# EAGLE design long-3.3v (EAGLE 7.2.0)
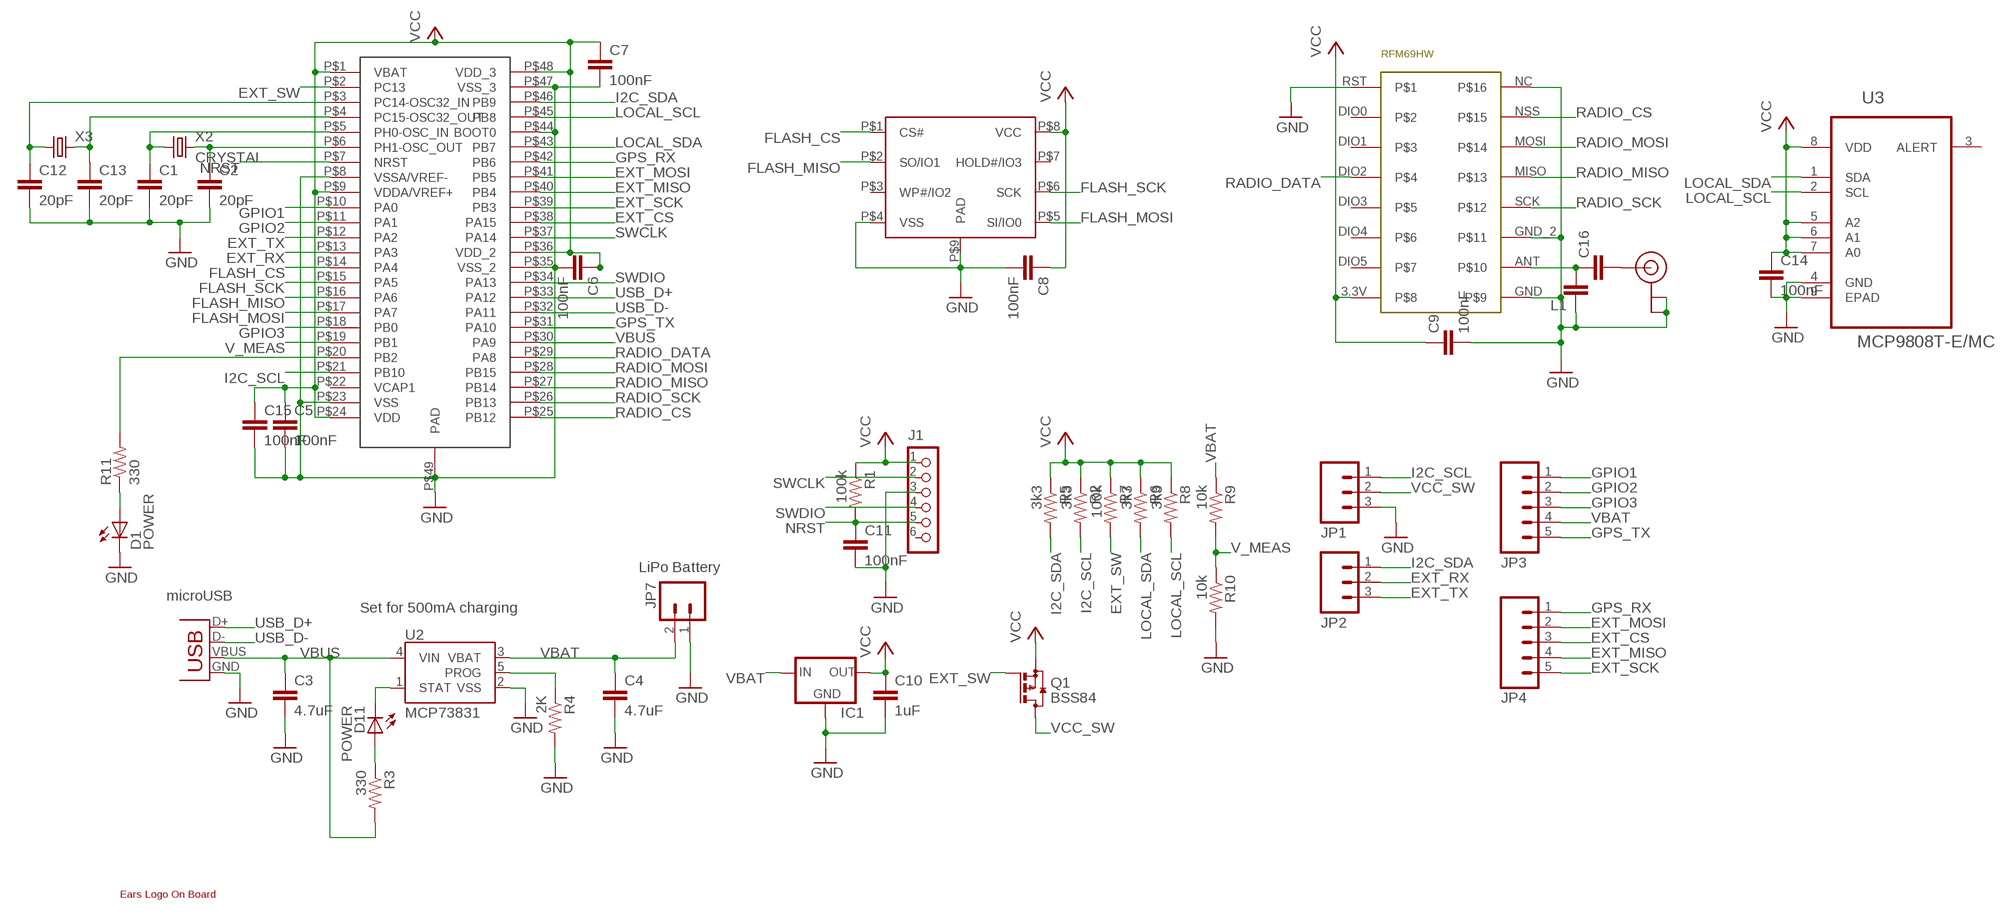
[diagram p0: schematic, sheet 1]

## Parts
C1  20pF  C-EUC0402  [C0402]
C2  20pF  C-EUC0402  [C0402]
C3  4.7uF  CAP0402-CAP  [0402-CAP]
C4  4.7uF  CAP0402-CAP  [0402-CAP]
C5  100nF  C-EUC0402  [C0402]
C6  100nF  C-EUC0402  [C0402]
C7  100nF  C-EUC0402  [C0402]
C8  100nF  C-EUC0402  [C0402]
C9  100nF  C-EUC0402  [C0402]
C10  1uF  C-EUC0402  [C0402]
C11  100nF  C-EUC0402  [C0402]
C12  20pF  C-EUC0402  [C0402]
C13  20pF  C-EUC0402  [C0402]
C14  100nF  C-EUC0402  [C0402]
C15  100nF  C-EUC0402  [C0402]
C16  C-EUC0402  [C0402]
D1  POWER  LED0603  [LED-0603]
D11  POWER  LED0603  [LED-0603]
IC1  XC63FPM  [SOT23]
J1  CON_HEADER_1X06-SMD-RIGHT-ANGLED  [M1X6_MALE_RIGHT_ANGLED_SMD]
JP1  M03PTH  [1X03]
JP2  M03PTH  [1X03]
JP3  M05PTH  [1X05]
JP4  M05PTH  [1X05]
JP7  LiPo Battery  M02-JST-2MM-SMT  [JST-2-SMD]
L1  C-EUC0402  [C0402]
Q1  BSS84  [SOT23]
R1  100k  RESISTOR0402-RES  [0402-RES]
R2  3k3  RESISTOR0402-RES  [0402-RES]
R3  330  RESISTOR0402-RES  [0402-RES]
R4  2K  RESISTOR0402-RES  [0402-RES]
R5  3k3  RESISTOR0402-RES  [0402-RES]
R6  3k3  RESISTOR0402-RES  [0402-RES]
R7  100k  RESISTOR0402-RES  [0402-RES]
R8  3k3  RESISTOR0402-RES  [0402-RES]
R9  10k  RESISTOR0402-RES  [0402-RES]
R10  10k  RESISTOR0402-RES  [0402-RES]
R11  330  RESISTOR0402-RES  [0402-RES]
U2  MCP73831  [SOT23-5]
U3  MCP9808T-E/MC  [DFN300X200X100-9N]
U$1  STM32F411CEU6  [STM32F411CEU6]
U$2  EARS-LOGO  [EARS-LOGO]
U$3  RFM69HW  [RFM69HW]
U$4  U.FL  [U.FL]
U$5  S25FL256  [WSON-8]
X1  Micro USB  USB-MICROB  [USB-MICROB]
X2  CRYSTAL  ABRACON_ABM3_CRYSTAL  [ABRACON_ABM3_CRYSTAL]
X3  CRYSTALS-NOGND-IQXC-25  [2.0X1.2-2PAD]

## Nets
EXT_CS: JP4.3 U$1.P$38(PA15)
EXT_MISO: JP4.4 U$1.P$40(PB4)
EXT_MOSI: JP4.2 U$1.P$41(PB5)
EXT_RX: JP2.2 U$1.P$13(PA3)
EXT_SCK: JP4.5 U$1.P$39(PB3)
EXT_SW: Q1.1(G) R7.2 U$1.P$2(PC13)
EXT_TX: JP2.3 U$1.P$12(PA2)
FLASH_CS: U$1.P$14(PA4) U$5.P$1(CS#)
FLASH_MISO: U$1.P$16(PA6) U$5.P$2(SO/IO1)
FLASH_MOSI: U$1.P$17(PA7) U$5.P$5(SI/IO0)
FLASH_SCK: U$1.P$15(PA5) U$5.P$6(SCK)
GND: C1.2 C2.2 C3.2 C4.2 C5.2 C6.2 C7.2 C8.2 C9.2 C10.2 C11.2 C12.2 C13.2 C14.2 C15.2 D1.C IC1.1(GND) J1.3 JP1.3 JP7.1 L1.1 R4.2 R10.2 U2.2(VSS) U3.4(GND) U3.9(EPAD) U$1.P$8(VSSA/VREF-) U$1.P$23(VSS) U$1.P$35(VSS_2) U$1.P$44(BOOT0) U$1.P$47(VSS_3) U$1.P$49(PAD) U$3.GND U$3.GND_2 U$3.NC U$3.RST U$4.P$1(GND) U$4.P$2(GND) U$5.P$4(VSS) U$5.P$9(PAD) X1.GND
GPIO1: JP3.1 U$1.P$10(PA0)
GPIO2: JP3.2 U$1.P$11(PA1)
GPIO3: JP3.3 U$1.P$18(PB0)
GPS_RX: JP4.1 U$1.P$42(PB6)
GPS_TX: JP3.5 U$1.P$31(PA10)
I2C_SCL: JP1.1 R2.2 U$1.P$21(PB10)
I2C_SDA: JP2.1 R5.2 U$1.P$46(PB9)
LOCAL_SCL: R8.2 U3.2(SCL) U$1.P$45(PB8)
LOCAL_SDA: R6.2 U3.1(SDA) U$1.P$43(PB7)
N$1: C1.1 U$1.P$5(PH0-OSC_IN) X2.P$1
N$2: C2.1 U$1.P$6(PH1-OSC_OUT) X2.P$2
N$3: D11.A R3.1
N$4: C16.2 U$4.P$3(SIGNAL)
N$5: C16.1 L1.2 U$3.ANT
N$6: C13.1 U$1.P$4(PC15-OSC32_OUT) X3.2
N$7: C12.1 U$1.P$3(PC14-OSC32_IN) X3.1
N$8: D1.A R11.1
N$9: R11.2 U$1.P$20(PB2)
NRST: C11.1 J1.5 R1.2 U$1.P$7(NRST)
PROG: R4.1 U2.5(PROG)
RADIO_CS: U$1.P$25(PB12) U$3.NSS
RADIO_DATA: U$1.P$29(PA8) U$3.DIO2
RADIO_MISO: U$1.P$27(PB14) U$3.MISO
RADIO_MOSI: U$1.P$28(PB15) U$3.MOSI
RADIO_SCK: U$1.P$26(PB13) U$3.SCK
STAT: D11.C U2.1(STAT)
SWCLK: J1.2 U$1.P$37(PA14)
SWDIO: J1.4 U$1.P$34(PA13)
USB_D+: U$1.P$33(PA12) X1.D+
USB_D-: U$1.P$32(PA11) X1.D-
V_MEAS: R9.2 R10.1 U$1.P$19(PB1)
VBAT: C4.1 IC1.3(IN) JP3.4 JP7.2 R9.1 U2.3(VBAT)
VBUS: C3.1 R3.2 U2.4(VIN) U$1.P$30(PA9) X1.VBUS
VCC: C5.1 C6.1 C7.1 C8.1 C9.1 C10.1 C14.1 C15.1 IC1.2(OUT) J1.1 Q1.2(S) R1.1 R2.1 R5.1 R6.1 R7.1 R8.1 U3.5(A2) U3.6(A1) U3.7(A0) U3.8(VDD) U$1.P$1(VBAT) U$1.P$9(VDDA/VREF+) U$1.P$24(VDD) U$1.P$36(VDD_2) U$1.P$48(VDD_3) U$3.3.3V U$5.P$8(VCC)
VCC_SW: JP1.2 Q1.3(D)
Unconnected: J1.6 U3.3(ALERT) U$1.P$22(VCAP1) U$3.DIO0 U$3.DIO1 U$3.DIO3 U$3.DIO4 U$3.DIO5 U$5.P$3(WP#/IO2) U$5.P$7(HOLD#/IO3)

## Notes on the sheet
- microUSB
- Set for 500mA charging

## Library data of the parts
C1 C2 C5-C16 L1 = rcl:C-EU: CAPACITOR, European symbol
C3 C4 = SparkFun:CAP: Capacitor Standard 0603 ceramic capacitor, and 0.1" leaded capacitor.
D1 D11 = SparkFun:LED: LEDs Standard schematic elements and footprints for 5mm, 3mm, 1206, and 0603 sized LEDs. 5mm - Spark Fun Electronics SKU : COM-00529 (and others)
IC1 = v-reg:XC63FP: Positiv Voltage Regulators www.torex.co.jp/english/product/pro02/pdf/0201_xc62fp.pdf
J1 = dp_devices:CON_HEADER_1X06
JP1 JP2 = SparkFun:M03: Header 3 Standard 3-pin 0.1" header. Use with straight break away headers (SKU : PRT-00116), right angle break away headers (PRT-00553), swiss pins (PRT-00743), machine pins (PRT-00117), and female headers (PRT-00115). Molex polarized connector foot print use with SKU : PRT-08232 with associated crimp pins and housings.
JP3 JP4 = SparkFun:M05: Header 5 Standard 5-pin 0.1" header. Use with straight break away headers (SKU : PRT-00116), right angle break away headers (PRT-00553), swiss pins (PRT-00743), machine pins (PRT-00117), and female headers (PRT-00115). Molex polarized connector foot print use with SKU : PRT-08230 with associated crimp pins and housings.
JP7 = SparkFun:M02: Header 2 Standard 2-pin 0.1" header. Use with straight break away headers (SKU : PRT-00116), right angle break away headers (PRT-00553), swiss pins (PRT-00743), machine pins (PRT-00117), and female headers (PRT-00115). Molex polarized connector foot print use with SKU : PRT-08233 with associated crimp pins and housings.
Q1 = transistor-small-signal:BSS84: P-CHANNEL MOS FET
R1-R11 = SparkFun:RESISTOR: Resistor Basic schematic elements and footprints for 0603, 1206, and PTH resistors.
U2 = SparkFun:MCP73831: Microchip's MCP73831 Miniature single cell, fully integrated Li-Ion, Li-polymer charge management controller http://ww1.microchip.com/downloads/en/DeviceDoc/21984a.pdf
U3 = mattsLib:MCP9808T-E/MC: TEMP SENSOR, I2C, -20 TO 100 DEG, 8DFN; MPN: MCP9808T-E/MC; OC_FARNELL: 2080524; OC_NEWARK: 73T0714; PACKAGE: 8DFN; SUPPLIER: Microchip
U$1 = STM32F411CEU6:STM32F411CEU6
U$2 = earsLogo:EARS-LOGO
U$3 = RFM69HW:RFM69HW
U$4 = SparkFun:U.FL
U$5 = mattsLib:S25FL256; OC_FARNELL: 2136254
X1 = SparkFun:USB: USB Connectors USB-B-PTH is fully proven SKU : PRT-00139 USB-miniB is fully proven SKU : PRT-00587 USB-A-PCB is untested. USB-A-H is throughly reviewed, but untested. Spark Fun Electronics SKU : PRT-00437 USB-B-SMT is throughly reviewed, but untested. Needs silkscreen touching up. USB-A-S has not been used/tested USB-MB-H has not been used/tested
X2 = Ava:ABRACON_ABM3_CRYSTAL; OC_FARNELL: 2101329
X3 = IQD-Frequency-Products:CRYSTALS-NOGND: CRYSTALS CAN NOT GROUNDED; OC_FARNELL: 2449502

## Board
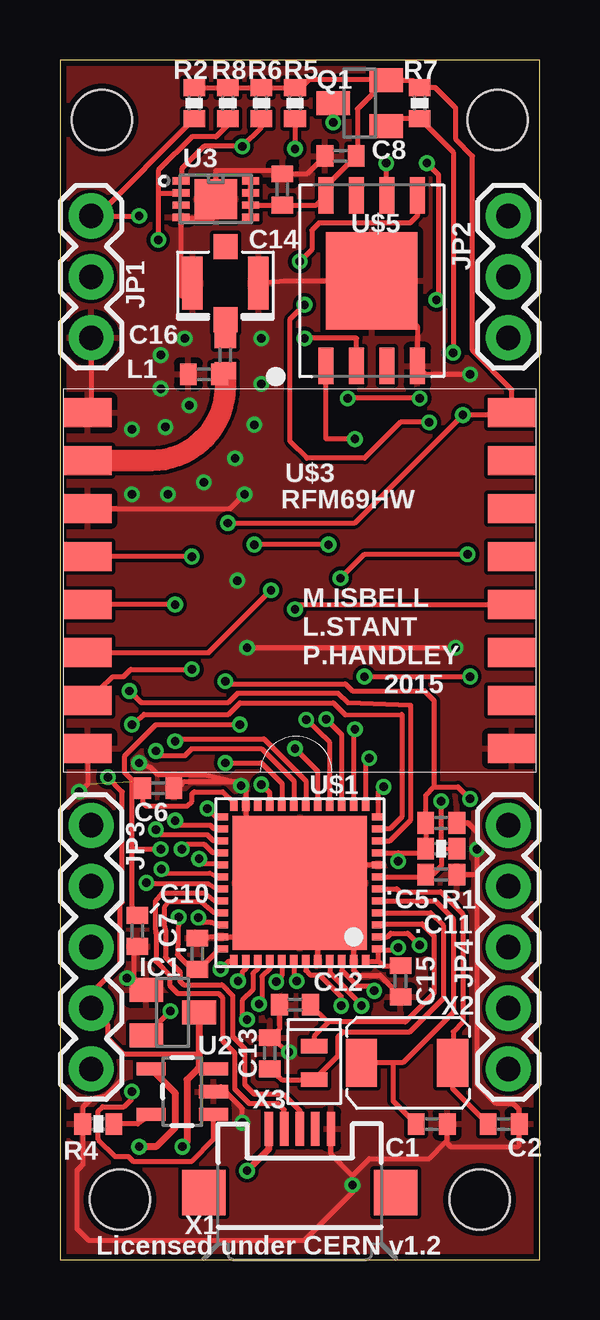
[diagram p1: board, top side]
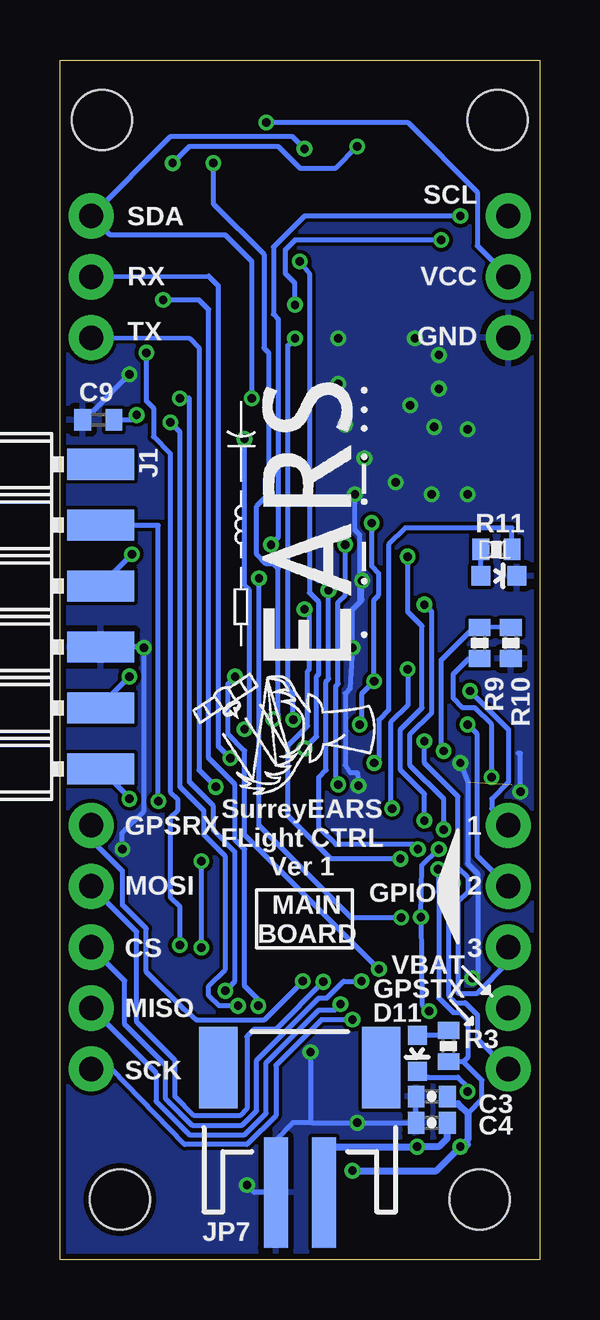
[diagram p2: board, bottom side, seen from below]

Size 20 x 50 mm. Coordinates in mm from the lower left corner, seen from the top.
Outline: 0,0 20,0 20,50 0,50 0,0
Copper layers (1*16): Top 0.035mm / dielectric 1.5mm / Bottom 0.035mm
Design rules "Elecrow_2-layer_eagle_rule": minimum track width 6mil, minimum drill 12mil, track to track 6mil, track to pad 6mil, pad to pad 6mil, via to via 6mil, smd to smd 0mil, copper to edge 10mil, drill to drill 10mil, minimum pad ring 10mil, minimum via ring 6mil, stop-mask expansion 2mil, vias tented up to drill 100mil, thermal gap 10mil
Holes 2.5 mm at 1.75,47.5 18.25,47.5 2.5,2.5 17.5,2.5
tKeepout: area 0,45 to 4.2,50; area 15.8,45 to 20,50; area 0,0 to 5,5; area 15,0 to 20,5
bKeepout: area 15.8,45 to 20,50; area 0,45 to 4.2,50; area 15,0 to 20,5; area 0,0 to 5,5
tRestrict: area 6,39.9 to 7.8,41.6

### Footprints (pad centres in the part's own frame; a part is rotated, then mirrored left to right if it is on the bottom)
C0402 = smd 0.7 x 0.9: 1 -0.65,0; 2 0.65,0
0402-CAP = smd 0.7 x 0.9: 1 -0.65,0; 2 0.65,0
LED-0603 = smd 0.8 x 0.8: A 0,-0.75; C 0,0.75
SOT23 = smd 1 x 1.4: 1 -0.95,-1.1; 2 0.95,-1.1; 3 0,1.1
M1X6_MALE_RIGHT_ANGLED_SMD = smd 1.3 x 2.8: 1 -6.35,-3.3; 2 -3.81,-3.3; 3 -1.27,-3.3; 4 1.27,-3.3; 5 3.81,-3.3; 6 6.35,-3.3
1X03 = drill 1.016 pad 1.88: 1 0,0; 2 2.54,0; 3 5.08,0
1X05 = drill 1.016 pad 1.88: 1 0,0; 2 2.54,0; 3 5.08,0; 4 7.62,0; 5 10.16,0
JST-2-SMD = smd 1 x 4.6: 1 -1,-3.7; 2 1,-3.7 | smd 1.6 x 3.4: NC1 -3.4,1.5; NC2 3.4,1.5
0402-RES = smd 0.7 x 0.9: 1 -0.65,0; 2 0.65,0
SOT23-5 = smd 0.55 x 1.2: 1 -0.95,-1.3; 2 0,-1.3; 3 0.95,-1.3; 4 0.95,1.3; 5 -0.95,1.3
DFN300X200X100-9N = smd 0.711 x 0.305: 1 -1.448,0.762; 2 -1.448,0.254; 3 -1.448,-0.254; 4 -1.448,-0.762; 5 1.448,-0.762; 6 1.448,-0.254; 7 1.448,0.254; 8 1.448,0.762 | smd 1.753 x 1.651: 9 0,0
STM32F411CEU6 = smd 0.55 x 0.3: P$1 0.225,6.25; P$2 0.225,5.75; P$3 0.225,5.25; P$4 0.225,4.75; P$5 0.225,4.25; P$6 0.225,3.75; P$7 0.225,3.25; P$8 0.225,2.75; P$9 0.225,2.25; P$10 0.225,1.75; P$11 0.225,1.25; P$12 0.225,0.75; P$25 6.775,0.75; P$26 6.775,1.25; P$27 6.775,1.75; P$28 6.775,2.25; P$29 6.775,2.75; P$30 6.775,3.25; P$31 6.775,3.75; P$32 6.775,4.25; P$33 6.775,4.75; P$34 6.775,5.25; P$35 6.775,5.75; P$36 6.775,6.25 | smd 0.3 x 0.55: P$13 0.75,0.225; P$14 1.25,0.225; P$15 1.75,0.225; P$16 2.25,0.225; P$17 2.75,0.225; P$18 3.25,0.225; P$19 3.75,0.225; P$20 4.25,0.225; P$21 4.75,0.225; P$22 5.25,0.225; P$23 5.75,0.225; P$24 6.25,0.225; P$37 6.25,6.775; P$38 5.75,6.775; P$39 5.25,6.775; P$40 4.75,6.775; P$41 4.25,6.775; P$42 3.75,6.775; P$43 3.25,6.775; P$44 2.75,6.775; P$45 2.25,6.775; P$46 1.75,6.775; P$47 1.25,6.775; P$48 0.75,6.775 | smd 5.6 x 5.6: P$49 3.5,3.5
RFM69HW = smd 2 x 1.2: 3.3V -9,-7.2; ANT 8.7,-5.2; DIO0 -9,4.8; DIO1 -9,2.8; DIO2 -9,0.8; DIO3 -9,-1.2; DIO4 -9,-3.2; DIO5 -9,-5.2; GND 8.7,-7.2; GND_2 8.7,-3.2; MISO 8.7,0.8; MOSI 8.7,2.8; NC 8.7,6.8; NSS 8.7,4.8; RST -9,6.8; SCK 8.7,-1.2
U.FL = smd 2.2 x 0.85: P$1 0,1.375; P$2 0,-1.375 | smd 1.05 x 1: P$3 1.525,0; P$4 -1.525,0
WSON-8 = smd 1.524 x 0.635: P$1 -3.556,1.905; P$2 -3.556,0.635; P$3 -3.556,-0.635; P$4 -3.556,-1.905; P$5 3.556,-1.905; P$6 3.556,-0.635; P$7 3.556,0.635; P$8 3.556,1.905 | smd 4.064 x 3.81: P$9 0,0
USB-MICROB = smd 0.35 x 1.4: D+ 0,2.65; D- -0.65,2.65; GND 1.3,2.65; ID 0.65,2.65; VBUS -1.3,2.65 | smd 1.8 x 1.9: MT1 -4,0; MT2 4,0
ABRACON_ABM3_CRYSTAL = smd 1.3 x 2: P$1 -3.4,0.1; P$2 0.4,0.1
2.0X1.2-2PAD = smd 0.6 x 1.1: 1 -0.7,0; 2 0.7,0

### Placement (x,y rotation side)
C1  15.5,5.65 0 top
C2  18.5,5.65 0 top
C3  4.5,6.8 180 bottom
C4  4.5,5.7 180 bottom
C5  15.9,18.2 0 top
C6  4.1,19.65 0 top
C7  5.72,12.75 90 top
C8  11.7,46 180 top
C9  18.4,35 180 bottom
C10  3.23,13.7 270 top
C11  15.9,16.05 0 top
C12  9.8,10.62 180 top
C13  8.75,8.6 90 top
C14  9.28,44.6 90 top
C15  14.2,11.6 270 top
C16  6.9,37.7 90 top
D1  1.7,28.5 270 bottom
D11  5.1,8.6 180 bottom
IC1  4.7,10.3 270 top
J1  21.6,26.8 90 bottom
JP1  1.3,43.5 270 top
JP2  18.7,43.5 270 top
JP3  1.3,18.1 270 top
JP4  18.7,18.1 270 top
JP7  10,6.5 0 bottom
L1  6,36.9 0 top
Q1  12.5,48.2 90 top
R1  15.9,17.12 0 top
R2  5.6,48.2 270 top
R3  3.8,8.9 270 bottom
R4  1.6,5.65 180 top
R5  9.8,48.2 270 top
R6  8.4,48.2 270 top
R7  15,48.2 270 top
R8  7,48.2 270 top
R9  2.5,25.7 90 bottom
R10  1.2,25.7 270 bottom
R11  1.8,29.6 0 bottom
U2  5.1,7 90 top
U3  6.5,44.2 0 top
U$1  13.5,19.2 180 top
U$2  9.7,28.8 90 bottom
U$3  9.85,28.1 180 top
U$4  6.9,40.7 270 top
U$5  13,40.8 90 top
X1  10,2.8 0 top
X2  15.97,8.1 0 top
X3  10.6,8.2 270 top

### Tracks (layer width: path | path; a pad name or v marks a point on that pad's centre or on a via)
EXT_CS  (via drill 0.35)
  Top 0.2: U$1.P$38 7.75,12.12 7.6,11.97 7.6,11.8 v7.42,11.6
  Bottom 0.2: v7.42,11.6 8.18,11.6 8.88,10.9 9.2,10.9 11.8,8.3 11.8,6.2 12.4,5.6 14.5,5.6 15.6,6.7 15.6,8.1 17.3,9.8 17.3,11.62 JP4.3
EXT_MISO  (via drill 0.35)
  Top 0.2: U$1.P$40 8.75,12.12 8.43,11.8 8.43,10.78 v8.3,10.65
  Bottom 0.2: v8.3,10.65 8.55,10.4 9.2,10.4 11.4,8.2 11.4,6.1 12.3,5.2 14.6,5.2 16,6.6 16,7.78 JP4.4
EXT_MOSI  (via drill 0.35)
  Top 0.2: U$1.P$41 9.25,11.85 v9.03,11.57
  Bottom 0.2: v9.03,11.57 11,9.6 11.9,9.6 12.2,9.3 12.2,6.3 12.5,6 14.4,6 15.2,6.8 15.2,8.3 16.8,9.9 16.8,13.66 JP4.2
EXT_RX  (via drill 0.35)
  Top 0.2: U$1.P$13 12.75,20.75 v12.9,20.9
  Bottom 0.2: v12.9,20.9 13.4,21.4 13.4,40.6 13.8,41 JP2.2
EXT_SCK  (via drill 0.35)
  Top 0.2: U$1.P$39 8.25,12.12 8.05,11.93 8.05,11.25 7.6,10.8 7.6,10.2 v7.8,10
  Bottom 0.2: v7.8,10 9.1,10 11,8.1 11,6 12.2,4.8 14.8,4.8 17.84,7.94 JP4.5
EXT_SW  (via drill 0.35)
  Top 0.2: U$1.P$2 13.65,13.45 13.8,13.6 14.5,13.6 v15,13.1 | Q1.1 13.9,47.55 R7.2 16.4,46.15 v16.4,37.8
  Bottom 0.2: v15,13.1 15,14.7 15.4,15.1 15.4,18.4 15.1,18.7 15.1,19.2 15.4,19.5 15.4,33.6 16.1,34.3 16.1,35.5 16.4,35.8 v16.4,37.8
EXT_TX  (via drill 0.35)
  Top 0.2: U$1.P$12 13.28,19.48 v13.5,19.7
  Bottom 0.2: v13.5,19.7 14.2,20.4 14.2,38 14.6,38.4 JP2.3
FLASH_CS  (via drill 0.35)
  Top 0.2: U$1.P$14 12.25,21.95 v12.3,22.1 | v12.3,34.2 11.1,34.2 U$5.P$1
  Bottom 0.2: v12.3,22.1 12.1,22.3 12.1,27.9 12.3,28.1 v12.3,34.2
FLASH_MISO  (via drill 0.35)
  Top 0.2: U$1.P$16 11.25,21.55 v10.28,22.5 | U$5.P$2 12.37,38.4 v10.2,38.4
  Bottom 0.2: v10.28,22.5 10.28,23.55 10.5,23.8 10.5,38.1 v10.2,38.4
FLASH_MOSI  (via drill 0.35)
  Top 0.2: U$1.P$17 10.75,20.35 v9.8,21.3 | U$5.P$5 14.9,43.51 14.6,43.2 10.8,43.2 10.5,42.9 10.5,42.1 v10,41.6
  Bottom 0.2: v9.8,21.3 9.3,21.8 9.3,24.3 9.2,24.4 9.2,27.4 9.6,27.8 9.6,41.1 v10,41.6
FLASH_SCK  (via drill 0.35)
  Top 0.2: U$1.P$15 11.75,21.88 v11.1,22.52 | v13.6,45.7 13.6,44.39 U$5.P$6
  Bottom 0.2: v13.6,45.7 13.6,44 11.5,41.9 11.5,38 11.3,37.8 11.3,31.9 11.8,31.4 11.8,29.4 11.4,29 11.1,29 10.9,28.8 10.9,22.73 v11.1,22.52
GND  (via drill 0.35)  (1 unrouted)
  Top 0.2: 9.65,15.35 7.75,13.45 U$1.P$35 C7.2 | 9.65,15.35 U$1.P$49 | U$1.P$49 7.75,17.95 U$1.P$23 7.75,19.55 v7.55,19.75 7.4,19.9 5.15,19.9 5,19.75 4.85,19.65 4.8,19.6 C6.2 | U$1.P$8 10.75,16.45 U$1.P$49 | U$1.P$44 10.75,14.25 9.65,15.35 | U$1.P$49 12.25,13.45 U$1.P$47 12.25,12.05 12.45,11.85 13.35,11.85 14.2,11 C15.2 | 12.2,3.5 11.3,4.4 X1.GND | 12.2,3.5 v12.2,3.1 12.2,2.8 10.2,0.8 1.2,0.8 0.7,1.3 0.7,3.7 0.95,3.95 R4.2 0.95,6.35 1.3,6.7 1.8,6.8 1.9,6.8 2.6,7.5 | 12.2,3.5 12.9,4.2 15.4,4.2 16.1,4.9 | 16.1,4.9 16.15,4.95 C1.2 | C12.2 9.15,9.6 C13.2 v9.55,8.65 | v7.6,5.7 7.6,6.3 6.7,7.2 U2.2 | C11.2 17.4,16.05 | 17.4,16.05 v17.4,17.1 17.4,17.8 17,18.2 C5.2 | IC1.1 3.45,11.25 3.1,11.6 3.1,11.72 | 3.1,11.72 3.1,12.7 C10.2 3.2,13.1 | v16.5,25.5 v7.8,25.5 | v17.1,36.9 15.25,36.9 U$5.P$4 14.9,38.9 U$5.P$9 9.38,40.8 U$4.P$1 | U$4.P$2 5.05,40.17 U3.4 5.09,43.4 6.4,43.4 6.5,43.5 U3.9 6.5,45.4 9.12,45.4 C14.2 10.3,45.25 C8.2 | JP1.3 1.3,35.45 U$3.GND | 16.1,4.9 16.3,4.7 19.1,4.7 19.15,4.75 C2.2 19.15,6.25 18.9,6.5 18.2,6.5 17.4,7.3 17.4,16.05 | U$3.GND_2 7.1,31.3 v7.7,31.9 | 7.6,19.8 6.9,20 6,20.2 4.1,20.2 3.8,20.5 v3.3,20.7 | v2.8,11.72 3.1,11.72 | U$3.NC 1.15,19.8 v0.8,19.5
  Bottom 0.2: C3.2 C4.2 v7.6,5.7 9.5,5.7 | v12.2,3.1 11.9,2.8 JP7.1 11,5 10.3,5.7 9.5,5.7 | v9.55,8.65 9.55,5.75 9.5,5.7 | v17.4,17.1 17.4,17.8 16.5,18.7 v16.5,25.5 16.53,25.53 J1.3 | v7.55,19.75 7.6,20.3 7.9,20.3 8.1,20.6 8.1,23.6 7.9,23.8 v7.8,25.5 7.8,27.1 7.5,27.4 | v17.1,36.9 19,35 C9.2 | 7.5,27.4 7.5,30.2 7.7,30.4 v7.7,31.9 | v3.3,20.7 3,19.9 3,16.5 2.58,16.07 2.58,11.93 v2.8,11.72 | v0.8,19.5 0.8,21.1 0.9,21.1 | 7.5,27.4 7.4,27.5 v7.4,28.3
  other vias: 3,34.6 5.4,35.6 4.2,37.7 3,31.9 4.5,31.9 6,32.4 7.3,33.4 8.1,34.8 8.4,36.5 5.2,38.4 8.4,38.4 4.4,34.7 4.2,36.3
  pour Top (isolate 0.4): 0,30.7 2.2,30.7 arc90
  pour Top: 0,50 20,50 20,0 0,0 0,30.7
  pour Bottom: 0,50 20,50 20,0 0,0
GPIO1  (via drill 0.35)
  Top 0.2: U$1.P$10 13.75,17.45 14.62,18.32 14.62,23.1 12,23.2 11.6,23.6 7.4,23.6 7,23.2 3.4,23.2 v2.9,23.7
  Bottom 0.2: v2.9,23.7 1.3,22.1 1.3,19.9 2,19.2 2,18.8 JP3.1
GPIO2  (via drill 0.35)
  Top 0.2: v3,22.3 3.5,22.73 7.03,22.73 7.5,23.2 11.4,23.2 11.9,22.7 14.25,22.73 14.25,18.45 13.75,17.95 U$1.P$11
  Bottom 0.2: JP3.2 1.64,15.86 2.6,16.82 2.6,21.9 v3,22.3
GPIO3  (via drill 0.35)
  Top 0.2: 10.3,19.02 U$1.P$18 10.25,19.95 8.5,21.7 4.9,21.7 v4.8,21.6
  Bottom 0.2: v4.8,21.6 4.8,20.7 3.4,19.3 3.4,16.32 3,15.93 3,15.3 3.4,14.9 3.4,11.1 2.6,11.1 1.3,12.4 JP3.3
GPS_RX  (via drill 0.35)
  Top 0.2: U$1.P$42 9.75,11.75 v9.88,11.6
  Bottom 0.2: v9.88,11.6 11.5,9.97 14.3,9.97 14.8,10.4 16.4,12 16.4,13.8 17.4,14.8 17.4,16.2 18.7,17.5 JP4.1
GPS_TX  (via drill 0.35)
  Top 0.2: U$1.P$31 arc90 6.67,15.5 6.45,15.5 6.2,15.65 3.65,15.65 v3.6,15.7
  Bottom 0.2: v3.6,15.7 3.8,15.5 3.8,11 3.5,10.7 3.1,10.7 2.6,10.2 2.6,9.2 1.34,7.94 JP3.5
I2C_SCL  (via drill 0.35)
  Top 0.2: U$1.P$21 8.75,19.45 v8.4,19.8 | JP1.1 1.55,43.5 | 1.55,43.5 R2.2 | 1.55,43.5 v3.3,43.5 | v11.2,29.8 v8.1,29.8
  Bottom 0.2: v8.4,19.8 8.5,19.9 8.5,23.9 8.4,24 8.4,27.4 8.1,27.7 v8.1,29.8 | v3.3,43.5 9.8,43.5 11.1,42.2 11.1,39.4 10.9,39.2 10.9,30.1 v11.2,29.8
I2C_SDA  (via drill 0.35)
  Top 0.2: U$1.P$46 11.75,12.05 12.4,11.4 12.9,11.4 v13.1,11.2 | R5.2 v9.8,46.3 | v15,35.9 v12,35.9
  Bottom 0.2: v13.1,11.2 12.7,11.6 12.7,17 13.6,17.9 13.6,18.9 14.6,19.9 14.6,35.9 v15,35.9 | v12,35.9 12,41.6 13.1,42.7 17.9,42.7 JP2.1 15.4,46.8 10.3,46.8 v9.8,46.3
LOCAL_SCL  (via drill 0.35)
  Top 0.2: U$1.P$45 11.25,11.95 12.57,10.62 v12.57,10.57 | R8.2 7,47.3 6.5,46.8 5.5,46.8 4.1,45.4 4.1,44.45 | 4.1,44.45 U3.2 | 4.1,44.45 v4.1,42.5 | v15.4,34.9 14.2,34.9 12.7,33.4 10.3,33.4 9.6,34.1 9.6,39.2 v10.2,39.8
  Bottom 0.2: v12.57,10.57 13.38,10.57 13.8,11 13.8,11.4 13.1,12.1 13.1,16.8 14,17.7 14,18.7 15,19.7 15,34.5 v15.4,34.9 | v4.1,42.5 10.2,42.5 10.6,42.1 10.6,41.1 10.2,40.7 v10.2,39.8
LOCAL_SDA  (via drill 0.35)
  Top 0.2: U$1.P$43 10.25,12.05 10.43,11.88 10.82,11.88 11.72,10.97 v11.72,10.57 | U3.1 5.1,45.01 5.1,45.5 6,46.4 v7.6,46.4 8.4,47.2 R6.2 | v15.7,40 15.8,40 15.8,45.2 v15.3,45.7
  Bottom 0.2: v11.72,10.57 11.72,10.82 12.3,11.4 12.3,17.1 12.7,17.5 12.7,19.8 13.8,20.9 13.8,39.6 14.2,40 v15.7,40 | v15.3,45.7 14.6,46.4 10.9,46.4 10,45.5 8.5,45.5 v7.6,46.4
N$1
  Top 0.2: 13.9,8.2 X2.P$1 | C1.1 13.9,6.6 13.9,8.2 | U$1.P$5 15.65,14.95 16.4,14.2 16.4,10.3 14.3,8.2 13.9,8.2
N$2
  Top 0.2: U$1.P$6 14.05,15.45 14.18,15.32 15.88,15.32 16.8,14.4 16.8,9.9 16.4,9.5 16.4,8.22 X2.P$2 16.38,7.12 C2.1
N$3
  Bottom 0.2: R3.1 3.9,9.3 3.95,9.35 D11.A
N$4
  Top 0.6: U$4.P$3 C16.2
N$5
  Top 0.6: 6.9,36.9 C16.1 6.8,37.05 L1.2
  Top 0.9: U$3.ANT 3.8,33.3 arc90 6.9,36.4 6.9,36.9
N$6
  Top 0.2: C13.1 9.25,7.5 X3.2 11.6,8.5 11.6,9.3 11.8,9.5 14.6,9.5 16,10.9 16,13.9 15.45,14.45 U$1.P$4
N$7
  Top 0.2: 11.15,9.85 11.2,9.9 14.4,9.9 15.6,11.1 15.6,13.5 15.1,14 13.3,14 U$1.P$3 | 11.15,9.85 10.6,9.3 X3.1 | C12.1 11.15,9.93 11.15,9.85
N$8
  Bottom 0.2: D1.A R11.1
N$9  (via drill 0.35)
  Top 0.2: v6.9,20.7 8.4,20.7 9.25,19.85 U$1.P$20
  Bottom 0.2: R11.2 1.15,30.5 5.6,30.5 6.3,29.8 6.3,22.9 6.7,22.5 6.7,20.9 v6.9,20.7
NRST  (via drill 0.35)
  Top 0.2: U$1.P$7 14.95,15.95 C11.1 15.55,16.05 15.9,16.4 15.9,17.1 | R1.2 16.32,17.12 15.9,17.1 | 15.9,17.1 v15.9,19.1
  Bottom 0.2: v15.9,19.1 15.9,30.6 J1.5
PROG
  Top 0.2: U2.5 3.25,5.65 R4.1
RADIO_CS  (via drill 0.35)
  Top 0.2: v6.15,18.8 6.5,18.45 U$1.P$25 | U$3.NSS 2.2,24.3 2.65,24.3 2.95,24.6 v5.5,24.6
  Bottom 0.2: v6.15,18.8 6.2,18.95 6.2,22.4 5.5,23.1 v5.5,24.6
RADIO_DATA  (via drill 0.35)
  Top 0.2: U$1.P$29 6.67,16.5 6,16.5 v5.8,16.7 | v9.8,27.1 10,27.3 U$3.DIO2
  Bottom 0.2: v5.8,16.7 8.7,16.7 10.5,18.5 10.5,21.43 9.68,22.25 9.68,24.52 9.6,24.6 9.6,26.9 v9.8,27.1
RADIO_MISO  (via drill 0.35)
  Top 0.2: U$1.P$27 6.4,17.45 6.15,17.7 4.22,17.7 v4,17.93 | v4.8,27.3 U$3.MISO
  Bottom 0.2: v4,17.93 4,19.2 5.4,20.6 5.4,21.9 4.5,22.8 4.5,27 v4.8,27.3
RADIO_MOSI  (via drill 0.35)
  Top 0.2: U$1.P$28 6.38,16.95 6.03,17.3 5.28,17.3 v5.08,17.1 | U$3.MOSI 6.2,25.3 v8.8,27.9
  Bottom 0.2: v5.08,17.1 5.28,17.3 8.5,17.3 9.2,18 9.2,20.1 8.9,20.4 8.9,24.1 8.8,24.2 v8.8,27.9
RADIO_SCK  (via drill 0.35)
  Top 0.2: U$1.P$26 6.42,17.95 6.28,18.1 5,18.1 v4.8,18.3 | v5.5,29.3 U$3.SCK
  Bottom 0.2: v4.8,18.3 4.8,19.4 5.8,20.4 5.8,22.1 4.9,23 4.9,26.4 5.5,27 v5.5,29.3
STAT  (via drill 0.35)
  Top 0.2: U2.1 6.4,5 5.5,4.1 3.05,4.1 2.85,4.3 2.3,4.3 1.6,5 1.6,6.2 1.77,6.38 2.67,6.38 3,6.7 v3,7
  Bottom 0.2: D11.C 4.65,7.6 3.4,7.6 3,7.2 v3,7
SWCLK  (via drill 0.35)
  Top 0.2: U$1.P$37 7.03,12.43 v6.7,12.1 | v12.7,24.3 v17.1,24.3
  Bottom 0.2: v6.7,12.1 12.3,17.7 12.3,21.2 13,21.9 13,24 v12.7,24.3 | v17.1,24.3 18.3,23.1 J1.2
SWDIO  (via drill 0.35)
  Top 0.2: U$1.P$34 6.67,14 6.45,14 6.3,14.05 5.97,14.05 v5.78,14.25 | v11.7,28.4 12.7,29.4 v17,29.4
  Bottom 0.2: v5.78,14.25 7.85,14.25 11.7,18.1 v11.7,28.4 | v17,29.4 18.3,28.1 J1.4
USB_D+
  Top 0.2: X1.D+ 10,6.2 9.3,6.9 8.1,6.9 7.7,7.3 7.7,8.8 7.2,9.3 7.2,11 6.75,11.45 5.15,11.45 5,11.6 5,12 4.4,12.6 4.4,13.7 4.35,13.93 4.35,14.68 4.5,14.9 5.9,14.9 6.45,14.45 U$1.P$33 6.75,14.45 6.7,14.5
USB_D-
  Top 0.2: X1.D- 9.35,6.25 9.1,6.5 7.9,6.5 7.3,7.1 7.3,8.6 6.8,9.1 6.8,10.9 6.62,11.07 4.92,11.07 4.6,11.4 4.6,11.82 4,12.43 4,13.6 3.98,13.8 3.98,14.9 4.28,15.28 6.03,15.28 6.45,14.95 U$1.P$32
V_MEAS  (via drill 0.35)
  Top 0.2: v4,21.2 4.2,21 5.2,21 5.5,21.3 8.4,21.3 9.75,19.95 U$1.P$19
  Bottom 0.2: v4,21.2 4.1,21.5 4.1,25 2.75,26.35 R9.2 2.55,26.4 R10.1
VBAT  (via drill 0.35)
  Top 0.2: 5.8,8.57 5.8,8.55 2.65,8.55 2,9.2 2,9.78 JP3.4 1.3,11.1 2.5,12.3 2.5,14.8 2.6,14.9 2.6,19.5 v2,20.1 | IC1.3
  Top 0.3: IC1.3 5.8,8.57 5.8,8 5.85,7.95 | U2.3 5.85,7.95 | 5.85,7.95 5.75,7.95 5.3,7.5 5.3,4.9 v5.1,4.7
  Bottom 0.2: v2,20.1 2,22.3 2.7,23 3.2,23 3.6,23.4 3.6,24.4 2.95,25.05 R9.1
  Bottom 0.3: JP7.2 9,4.7 v5.1,4.7 4.2,4.7 3.85,5.05 C4.1
VBUS  (via drill 0.35)
  Top 0.2: U$1.P$30 6.67,16 6.45,16 6.25,16.1 4.42,16.07 v4.22,16.27
  Top 0.3: X1.VBUS 8.7,4.6 v7.8,3.7 | U2.4 4.8,6.95 4.8,5.5 4,4.7 v3.3,4.7
  Bottom 0.2: 3.17,8.25 2.4,7.47 2.4,6.7 3,6.1 | 3.17,8.25 R3.2 | v4.22,16.27 4.22,15.32 4.2,15.3 4.2,10.9 3.6,10.3 3.3,10.3 3,10 3,8.43 3.17,8.25
  Bottom 0.3: v7.8,3.7 4.3,3.7 v3.3,4.7 | v3.3,4.7 3.1,4.7 3,4.8 | C3.1 3.9,6.75 3.9,6.5 3.4,6.5 3,6.1 3,5 v3.3,4.7
VCC  (via drill 0.35)
  Top 0.2: U$1.P$48 13.28,12.43 | 13.28,12.43 U$1.P$1 13.32,12.9 14,12.9 v14.1,13 | 13.28,12.43 13.45,12.25 C15.1 | U$1.P$9 14.1,16.95 | 14.1,16.95 15.03,16.95 R1.1 C5.1 15.25,19.35 15.6,19.7 | 15.6,19.7 16.6,19.7 v17.1,19.2 | v14.1,16.6 14.1,16.95 | C7.1 6,12.3 6.53,12.82 6.53,12.95 U$1.P$36 | C7.1 5.7,12.3 | C10.1 3.08,14.32 3,14.8 3,17.1 | 3,17.1 3,20 | 3,20 3.1,19.9 C6.1 3.45,19.05 3.6,18.9 5.3,18.9 5.5,19.1 5.5,19.4 5.6,19.5 6.8,19.5 7.25,19.05 U$1.P$24 | 3,20 2.7,20.3 2.7,21 4,22.3 v7.5,22.3 | v6.9,24.1 7,24 11.9,24 12.2,23.7 15.2,23.7 15.6,23.3 15.6,19.7 | v4.2,17.1 3,17.1 | U3.6 C14.1 10.69,43.95 U$5.P$8 11.1,44.74 C8.1 12.4,46 12.4,47.95 Q1.2 | U3.6 U3.7 U3.8 | U3.6 U3.5 | Q1.2 14.7,49.15 R7.1 15.65,48.85 16.5,48 16.5,46.7 17.2,46 17.2,37.9 18.85,36.25 U$3.3.3V 18.75,35.2 v16.8,35.2 12.3,30.7 v7,30.7 | R2.1 R8.1 R6.1 R5.1 10.05,48.85 10.4,49.2 13.55,49.2 Q1.2 | v4.6,10.35 IC1.2 | v4.95,14.28 4.9,12.7 5.3,12.3 5.7,12.3 | 5.7,12.3 5.7,12.18 C7.1
  Bottom 0.2: v17.1,19.2 17.1,19.25 J1.1 | v14.1,13 v14.1,16.6 | 4.78,10.53 v4.6,10.35 4.9,10.62 v4.95,14.28 4.9,16.45 4.25,17.1 v4.2,17.1 | v7.5,22.3 7.4,22.4 7.4,23.6 v6.9,24.1 6.9,27.5 6.7,27.7 6.7,28.6 7,28.9 v7,30.7 | v16.8,35.2 17,35 C9.1
VCC_SW  (via drill 0.35)
  Top 0.2: Q1.3 v11.4,47.4
  Bottom 0.2: v11.4,47.4 5.5,47.4 2.6,44.5 2.6,42.26 JP1.2

### Text on the board
tNames: RFM69HW | M.ISBELL / L.STANT / P.HANDLEY | 2015 | U$1 | . | . | . | X2 | Licensed under CERN v1.2
bNames: SCL | SDA | VCC | RX | GND | TX | 1 | SurreyEARS / FLight CTRL / Ver 1 | GPSRX | 2 | GPIO | MOSI | MAIN / BOARD | 3 | CS | VBAT | GPSTX | D11 | MISO | SCK